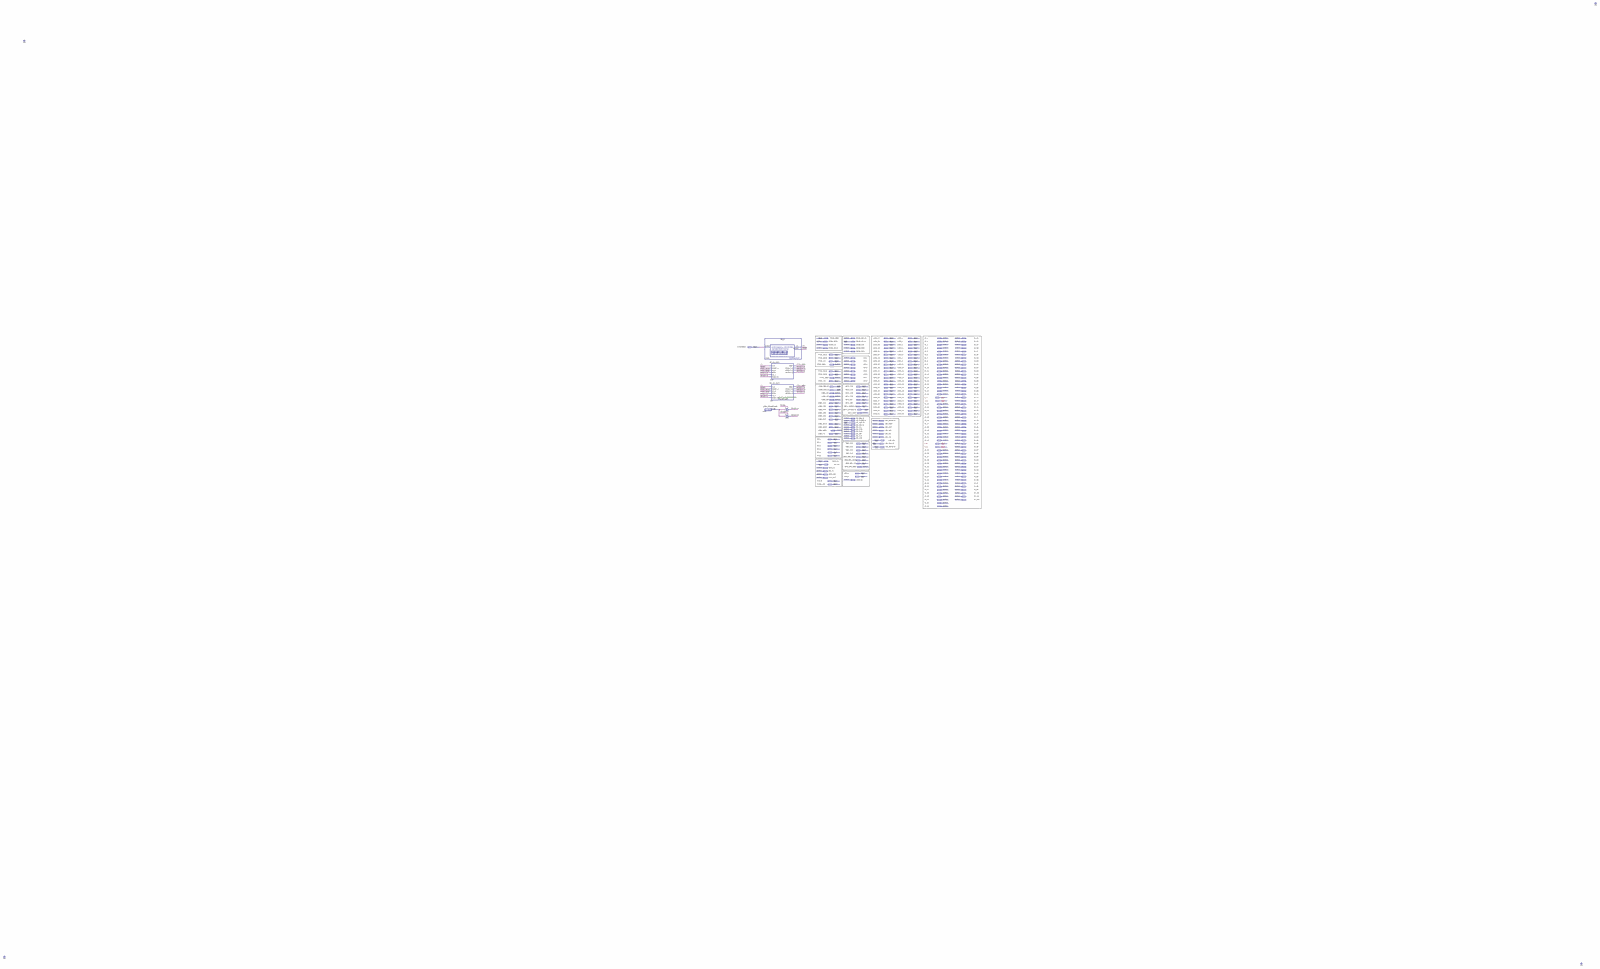
[diagram p0: schematic sheet, whole]
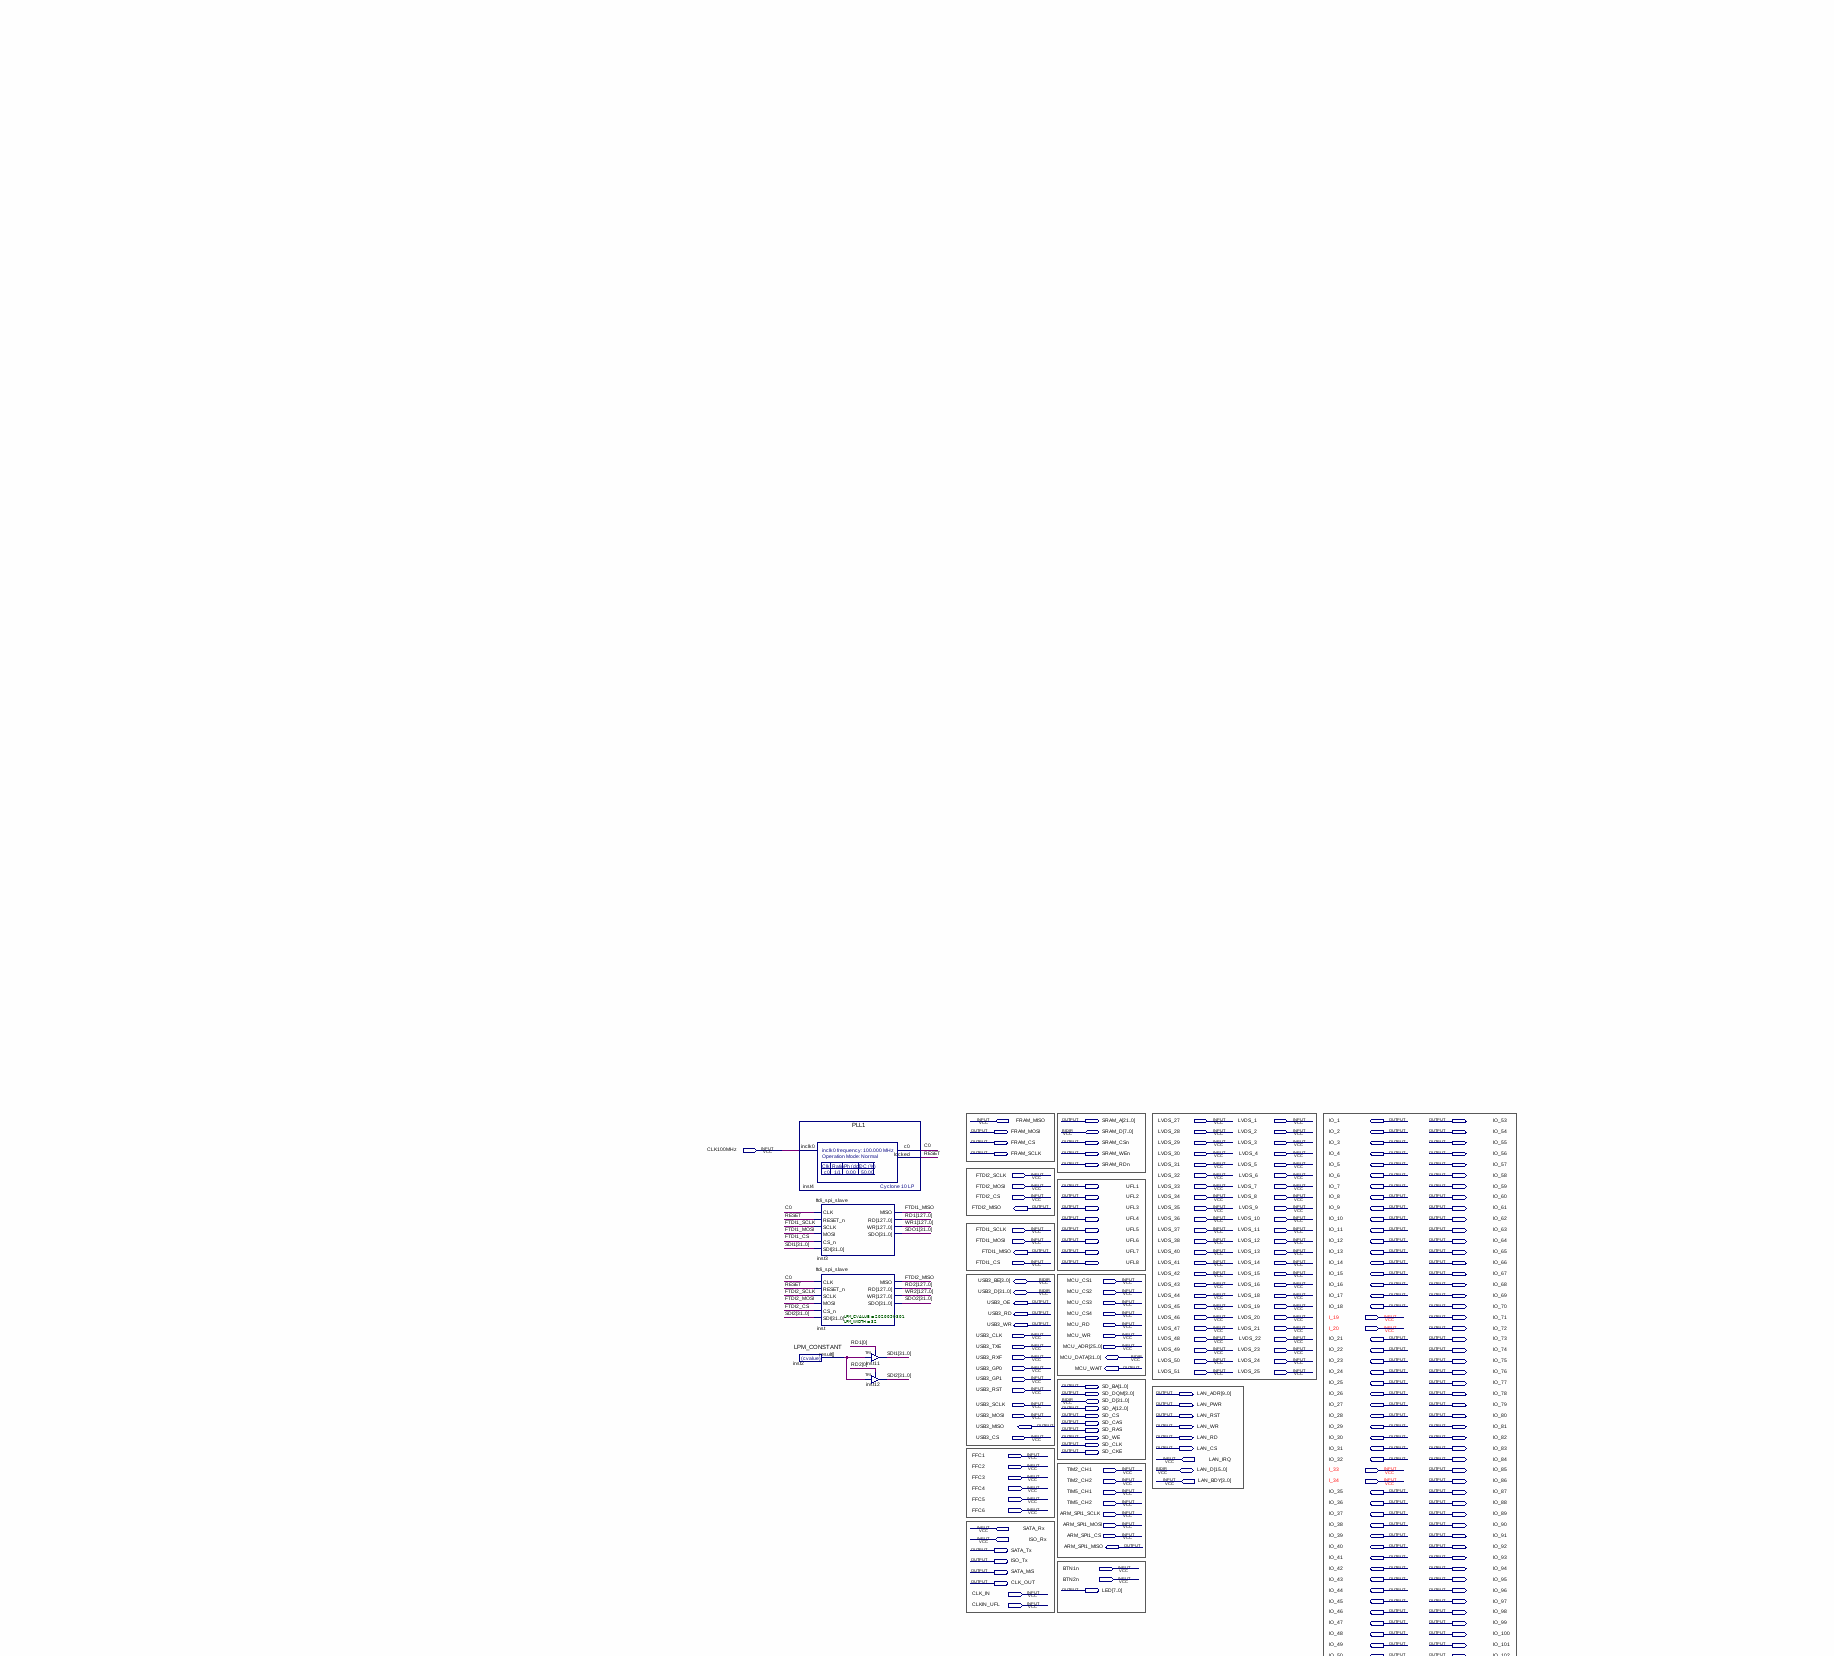
[diagram p1: schematic sheet, upper centre part]
// Quartus schematic 10CL120YF780I7G.bdf as structural Verilog: 6 symbols, 244 pins
module \10CL120YF780I7G  (
  input  FRAM_MISO,
  input  LVDS_27,
  input  LVDS_1,
  input  LVDS_28,
  input  LVDS_2,
  input  LVDS_29,
  input  LVDS_3,
  input  CLK100MHz,
  input  LVDS_30,
  input  LVDS_4,
  input  LVDS_31,
  input  LVDS_5,
  input  FTDI2_SCLK,
  input  LVDS_32,
  input  LVDS_6,
  input  FTDI2_MOSI,
  input  LVDS_33,
  input  LVDS_7,
  input  FTDI2_CS,
  input  LVDS_34,
  input  LVDS_8,
  input  LVDS_35,
  input  LVDS_9,
  input  LVDS_36,
  input  LVDS_10,
  input  FTDI1_SCLK,
  input  LVDS_37,
  input  LVDS_11,
  input  FTDI1_MOSI,
  input  LVDS_38,
  input  LVDS_12,
  input  LVDS_40,
  input  LVDS_13,
  input  FTDI1_CS,
  input  LVDS_41,
  input  LVDS_14,
  input  LVDS_42,
  input  LVDS_15,
  input  MCU_CS1,
  input  LVDS_43,
  input  LVDS_16,
  input  MCU_CS2,
  input  LVDS_44,
  input  LVDS_18,
  input  MCU_CS3,
  input  LVDS_45,
  input  LVDS_19,
  input  MCU_CS4,
  input  LVDS_46,
  input  LVDS_20,
  input  I_19,
  input  MCU_RD,
  input  LVDS_47,
  input  LVDS_21,
  input  I_20,
  input  USB3_CLK,
  input  MCU_WR,
  input  LVDS_48,
  input  LVDS_22,
  input  USB3_TXE,
  input  [25:0] MCU_ADR,
  input  LVDS_49,
  input  LVDS_23,
  input  USB3_RXF,
  input  LVDS_50,
  input  LVDS_24,
  input  USB3_GP0,
  input  LVDS_51,
  input  LVDS_25,
  input  USB3_GP1,
  input  USB3_RST,
  input  USB3_SCLK,
  input  USB3_MOSI,
  input  USB3_CS,
  input  FFC1,
  input  LAN_IRQ,
  input  FFC2,
  input  TIM2_CH1,
  input  I_33,
  input  FFC3,
  input  TIM2_CH2,
  input  [3:0] LAN_BDY,
  input  I_34,
  input  FFC4,
  input  TIM5_CH1,
  input  FFC5,
  input  TIM5_CH2,
  input  FFC6,
  input  ARM_SPI1_SCLK,
  input  ARM_SPI1_MOSI,
  input  SATA_Rx,
  input  ARM_SPI1_CS,
  input  ISO_Rx,
  input  BTN1n,
  input  BTN2n,
  input  CLK_IN,
  input  CLKIN_UFL,
  inout  [7:0] SRAM_D,
  inout  [3:0] USB3_BE,
  inout  [31:0] USB3_D,
  inout  [31:0] MCU_DATA,
  inout  [31:0] SD_D,
  inout  [15:0] LAN_D,
  output [21:0] SRAM_A,
  output IO_1,
  output IO_53,
  output FRAM_MOSI,
  output IO_2,
  output IO_54,
  output FRAM_CS,
  output SRAM_CSn,
  output IO_3,
  output IO_55,
  output FRAM_SCLK,
  output SRAM_WEn,
  output IO_4,
  output IO_56,
  output SRAM_RDn,
  output IO_5,
  output IO_57,
  output IO_6,
  output IO_58,
  output UFL1,
  output IO_7,
  output IO_59,
  output UFL2,
  output IO_8,
  output IO_60,
  output FTDI2_MISO,
  output UFL3,
  output IO_9,
  output IO_61,
  output UFL4,
  output IO_10,
  output IO_62,
  output UFL5,
  output IO_11,
  output IO_63,
  output UFL6,
  output IO_12,
  output IO_64,
  output FTDI1_MISO,
  output UFL7,
  output IO_13,
  output IO_65,
  output UFL8,
  output IO_14,
  output IO_66,
  output IO_15,
  output IO_67,
  output IO_16,
  output IO_68,
  output IO_17,
  output IO_69,
  output USB3_OE,
  output IO_18,
  output IO_70,
  output USB3_RD,
  output IO_71,
  output USB3_WR,
  output IO_72,
  output IO_21,
  output IO_73,
  output IO_22,
  output IO_74,
  output IO_23,
  output IO_75,
  output MCU_WAIT,
  output IO_24,
  output IO_76,
  output IO_25,
  output IO_77,
  output [1:0] SD_BA,
  output [3:0] SD_DQM,
  output [9:0] LAN_ADR,
  output IO_26,
  output IO_78,
  output LAN_PWR,
  output IO_27,
  output IO_79,
  output [12:0] SD_A,
  output SD_CS,
  output LAN_RST,
  output IO_28,
  output IO_80,
  output SD_CAS,
  output USB3_MISO,
  output LAN_WR,
  output IO_29,
  output IO_81,
  output SD_RAS,
  output SD_WE,
  output LAN_RD,
  output IO_30,
  output IO_82,
  output SD_CLK,
  output LAN_CS,
  output IO_31,
  output IO_83,
  output SD_CKE,
  output IO_32,
  output IO_84,
  output IO_85,
  output IO_86,
  output IO_35,
  output IO_87,
  output IO_36,
  output IO_88,
  output IO_37,
  output IO_89,
  output IO_38,
  output IO_90,
  output IO_39,
  output IO_91,
  output ARM_SPI1_MISO,
  output IO_40,
  output IO_92,
  output SATA_Tx,
  output IO_41,
  output IO_93,
  output ISO_Tx,
  output IO_42,
  output IO_94,
  output \SATA_M/S ,
  output IO_43,
  output IO_95,
  output CLK_OUT,
  output [7:0] LED,
  output IO_44,
  output IO_96,
  output IO_45,
  output IO_97,
  output IO_46,
  output IO_98,
  output IO_47,
  output IO_99,
  output IO_48,
  output IO_100,
  output IO_49,
  output IO_101,
  output IO_50,
  output IO_102,
  output IO_51,
  output IO_52
);

  wire C0, RESET;
  wire [31:0] inst2_result, SDI1, SDI2, SDO1, SDO2;
  wire [127:0] RD1, RD2, WR1, WR2;

  LPM_CONSTANT #(.LPM_CVALUE(2020090301), .LPM_WIDTH(32)) inst2 (.result(inst2_result));
  PLL1 inst4 (.inclk0(CLK100MHz), .c0(C0), .locked(RESET));
  ftdi_spi_slave inst3 (
    .CLK(C0), .RESET_n(RESET), .SCLK(FTDI1_SCLK), .MOSI(FTDI1_MOSI), .CS_n(FTDI1_CS), .SDI(SDI1),
    .MISO(FTDI1_MISO), .RD(RD1), .WR(WR1), .SDO(SDO1));
  ftdi_spi_slave inst (
    .CLK(C0), .RESET_n(RESET), .SCLK(FTDI2_SCLK), .MOSI(FTDI2_MOSI), .CS_n(FTDI2_CS), .SDI(SDI2),
    .MISO(FTDI2_MISO), .RD(RD2), .WR(WR2), .SDO(SDO2));
  TRI inst11[31:0] (.IN(inst2_result), .OE(RD1[0]), .OUT(SDI1));
  TRI inst12[31:0] (.IN(inst2_result), .OE(RD2[0]), .OUT(SDI2));
endmodule
